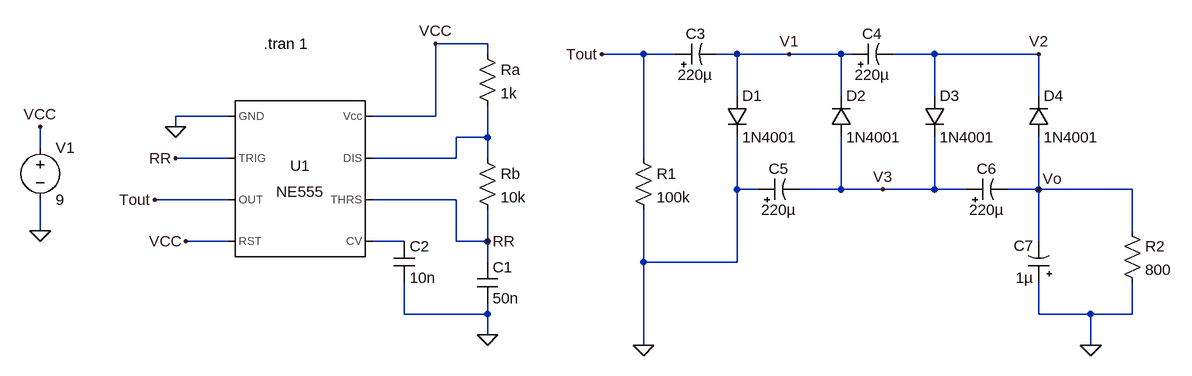
[diagram p0: schematic NegativeVoltageDoubler555.asc]
NegativeVoltageDoubler555.asc, the LTspice schematic file:
Version 4
SHEET 1 1716 680
WIRE 480 -16 400 -16
WIRE 480 0 480 -16
WIRE 720 0 656 0
WIRE 768 0 720 0
WIRE 864 0 832 0
WIRE 944 0 864 0
WIRE 1024 0 944 0
WIRE 1040 0 1024 0
WIRE 1168 0 1104 0
WIRE 1328 0 1168 0
WIRE 864 64 864 0
WIRE 1024 64 1024 0
WIRE 1168 64 1168 0
WIRE 1328 64 1328 0
WIRE 80 96 0 96
WIRE 400 96 400 -16
WIRE 400 96 304 96
WIRE 0 112 0 96
WIRE 480 128 480 80
WIRE 480 128 432 128
WIRE -208 144 -208 112
WIRE 80 160 0 160
WIRE 432 160 432 128
WIRE 432 160 304 160
WIRE 480 160 480 128
WIRE 720 160 720 0
WIRE 864 208 864 128
WIRE 896 208 864 208
WIRE 1024 208 1024 128
WIRE 1024 208 960 208
WIRE 1088 208 1024 208
WIRE 1168 208 1168 128
WIRE 1168 208 1088 208
WIRE 1216 208 1168 208
WIRE 1328 208 1328 128
WIRE 1328 208 1280 208
WIRE 1472 208 1328 208
WIRE 80 224 -32 224
WIRE 432 224 304 224
WIRE -208 272 -208 224
WIRE 1472 272 1472 208
WIRE 80 288 16 288
WIRE 352 288 304 288
WIRE 432 288 432 224
WIRE 480 288 480 240
WIRE 480 288 432 288
WIRE 1328 288 1328 208
WIRE 480 320 480 288
WIRE 720 320 720 240
WIRE 864 320 864 208
WIRE 864 320 720 320
WIRE 352 400 352 352
WIRE 480 400 480 384
WIRE 480 400 352 400
WIRE 1328 400 1328 352
WIRE 1408 400 1328 400
WIRE 1472 400 1472 352
WIRE 1472 400 1408 400
WIRE 480 432 480 400
WIRE 720 448 720 320
WIRE 1408 448 1408 400
FLAG 0 112 0
FLAG 0 160 RR
FLAG -208 112 VCC
FLAG 400 -16 VCC
FLAG 16 288 VCC
FLAG -208 272 0
FLAG 480 432 0
FLAG 720 448 0
FLAG 1328 208 Vo
FLAG 1408 448 0
FLAG 656 0 Tout
FLAG -32 224 Tout
FLAG 480 288 RR
FLAG 944 0 V1
FLAG 1328 0 V2
FLAG 1088 208 V3
SYMBOL Misc\\NE555 192 192 R0
SYMATTR InstName U1
SYMBOL voltage -208 128 R0
WINDOW 123 0 0 Left 0
WINDOW 39 0 0 Left 0
SYMATTR InstName V1
SYMATTR Value 9
SYMBOL res 464 -16 R0
SYMATTR InstName Ra
SYMATTR Value 1k
SYMBOL res 464 144 R0
SYMATTR InstName Rb
SYMATTR Value 10k
SYMBOL cap 464 320 R0
SYMATTR InstName C1
SYMATTR Value 50n
SYMBOL cap 336 288 R0
SYMATTR InstName C2
SYMATTR Value 10n
SYMBOL polcap 768 16 R270
WINDOW 0 32 32 VTop 2
WINDOW 3 0 32 VBottom 2
SYMATTR InstName C3
SYMATTR Value 220µ
SYMBOL polcap 1040 16 R270
WINDOW 0 32 32 VTop 2
WINDOW 3 0 32 VBottom 2
SYMATTR InstName C4
SYMATTR Value 220µ
SYMBOL polcap 896 224 R270
WINDOW 0 32 32 VTop 2
WINDOW 3 0 32 VBottom 2
SYMATTR InstName C5
SYMATTR Value 220µ
SYMBOL polcap 1216 224 R270
WINDOW 0 32 32 VTop 2
WINDOW 3 0 32 VBottom 2
SYMATTR InstName C6
SYMATTR Value 220µ
SYMBOL diode 848 64 R0
SYMATTR InstName D1
SYMATTR Value 1N4001
SYMBOL diode 1008 128 M180
WINDOW 0 24 64 Left 2
WINDOW 3 24 0 Left 2
SYMATTR InstName D2
SYMATTR Value 1N4001
SYMBOL diode 1152 64 R0
SYMATTR InstName D3
SYMATTR Value 1N4001
SYMBOL diode 1312 128 M180
WINDOW 0 24 64 Left 2
WINDOW 3 24 0 Left 2
SYMATTR InstName D4
SYMATTR Value 1N4001
SYMBOL res 704 144 R0
SYMATTR InstName R1
SYMATTR Value 100k
SYMBOL polcap 1344 352 R180
WINDOW 0 24 57 Left 2
WINDOW 3 24 8 Left 2
SYMATTR InstName C7
SYMATTR Value 1µ
SYMBOL res 1456 256 R0
SYMATTR InstName R2
SYMATTR Value 800
TEXT 136 -16 Left 2 !.tran 1

The netlist it stands for:
* NegativeVoltageDoubler555.asc
XU1 0 RR Tout VCC N002 RR N001 VCC NE555  ; pins GND TRIG OUT RST CV THRS DIS Vcc
V1 VCC 0 9
Ra VCC N001 1k
Rb N001 RR 10k
C1 RR 0 50n
C2 N002 0 10n
C3 Tout V1 220µ
C4 V1 V2 220µ
C5 0 V3 220µ
C6 V3 Vo 220µ
D1 V1 0 1N4001
D2 V3 V1 1N4001
D3 V2 V3 1N4001
D4 Vo V2 1N4001
R1 Tout 0 100k
C7 0 Vo 1µ
R2 Vo 0 800
.model D D
.lib standard.dio
.tran 1
.lib NE555.sub
.backanno
.end